# Altium schematic sheet Ledtourch.SchDoc
size A; SheetNumber: 1; SheetTotal: 1
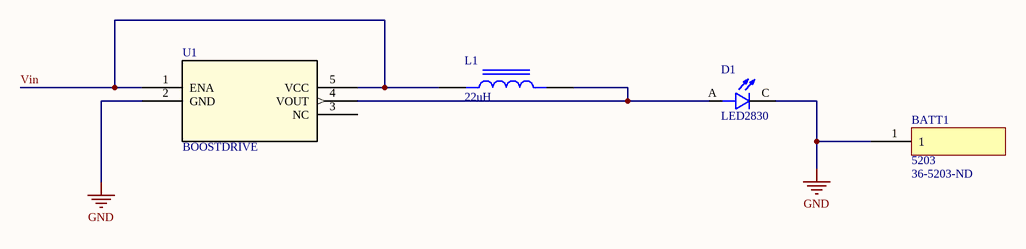
[diagram p0: Ledtourch.SchDoc]

## Parts
BATT1  5203  Supplier Part Number 1: 36-5203-ND  [AAA_BATT_SPRING_SOL]
D1  LED2830  [LED_OF-SMD2835Y]
L1  22uH  [IND_ASPI-0315S-220M-T]
U1  BOOSTDRIVE  [TSOT23-5_ZXLD383_DIO]

## Nets
GND: BATT1.1 D1.C U1.2(GND)
Vin: L1.1 U1.1(ENA) U1.5(VCC)
NetD1_A: D1.A L1.2 U1.4(VOUT)

Not connected (* = marked no-connect by the designer): U1 3(NC)

## Library data of the parts
BATT1 = 5203: 3M Half Facepiece Disposable Respirator Assembly 5203, OrganicVapor/Acid Gas; Manufacturer: Keystone Electronics; Supplier 1: Digikey; Manufacturer Part Number: 5203; RoHS: Yes; Category: Batteries and Accessories; Stock 1: 18441; Pricing 1: 1=0.45, 10=0.372, 25=0.3452, 100=0.3086, 500=0.271, 1000=0.25623, 2500=0.23794, 5000=0.22497 (USD); ComponentLink1URL: https://datasheet.ciiva.com/3/5203-3938.pdf?src-supplier=Digikey; ComponentLink1Description: https://datasheet.ciiva.com/3/5203-3938.pdf?src-supplier=Digikey; ComponentLink2URL: https://datasheet.ciiva.com/11714/0900766b8001d7c7-11714676.pdf?src-supplier=Rs; ComponentLink2Description: https://datasheet.ciiva.com/11714/0900766b8001d7c7-11714676.pdf?src-supplier=Rs; ComponentLink3URL: https://datasheet.ciiva.com/1390/1718267-1390390.pdf?src-supplier=Element14; ComponentLink3Description: https://datasheet.ciiva.com/1390/1718267-1390390.pdf?src-supplier=Element14; ComponentLink4URL: https://datasheet.ciiva.com/16499/m60-2p14-16499587.pdf?src-supplier=Future+Electronics; ComponentLink4Description: https://datasheet.ciiva.com/16499/m60-2p14-16499587.pdf?src-supplier=Future+Electronics
D1 = BXEN-40E-13H-9B-00-0-0: LED Uni-Color White 127lm 4000K Chip LED 2-Pin SMD T/R; Manufacturer: Bridgelux; Test Current: 100mA; Forward Voltage: 9.2V; Color Rendering Index (CRI): 80; Max Current Rating: 120mA; Viewing Angle: 116°; Thermal Resistance of Package: 10°C/W; Supplier 1: Digikey; Manufacturer Part Number: BXEN-40E-13H-9B-00-0-0; RoHS: No; Stock 1: 17000; Pricing 1: 17000=0.03041, 34000=0.02845, 51000=0.02747, 85000=0.02639, 119000=0.02576, 170000=0.02515 (USD); Mount: Surface Mount; Case/Package: 1113; Color: White; Case Code (Imperial): 1113; Correlated Color Temperature (CCT): 4000K; Packaging: Cut Tape; Series: 2835; ComponentLink1URL: http://www.bridgelux.com/sites/default/files/resource_media/DS58_Rev%20B%20Gen2%20SMD%202835%201W%209V%20Data%20sheet.pdf?src-supplier=Digikey; ComponentLink1Description: http://www.bridgelux.com/sites/default/files/resource_media/DS58_Rev%20B%20Gen2%20SMD%202835%201W%209V%20Data%20sheet.pdf?src-supplier=Digikey; Supplier Part Number 1: 976-1620-2-ND
L1 = ASPI-0315S-220M-T: Inductor Power Shielded Wirewound 22uH 20% 100KHz 400mA 430mOhm DCR T/R; Manufacturer: Abracon; Supplier 1: Digikey; Manufacturer Part Number: ASPI-0315S-220M-T; RoHS: Yes; Category: Fixed Inductors; Stock 1: 2923; Pricing 1: 1=0.54, 10=0.446, 100=0.3666, 1000=0.30148 (USD); ComponentLink1URL: https://datasheet.ciiva.com/1080/aspi-s315-4614rd-1080391.pdf?src-supplier=Digikey; ComponentLink1Description: https://datasheet.ciiva.com/1080/aspi-s315-4614rd-1080391.pdf?src-supplier=Digikey; ComponentLink2URL: https://datasheet.ciiva.com/1080/aspi-0315s-1080392.pdf?src-supplier=Digikey; ComponentLink2Description: https://datasheet.ciiva.com/1080/aspi-0315s-1080392.pdf?src-supplier=Digikey; ComponentLink3URL: https://datasheet.ciiva.com/8518/aspi-0315s-8518249.pdf?src-supplier=Avnet; ComponentLink3Description: https://datasheet.ciiva.com/8518/aspi-0315s-8518249.pdf?src-supplier=Avnet; Supplier Part Number 1: 535-ASPI-0315S-220M-TCT-ND
U1 = ZXLD383ET5TA: ZXLD383 Series 50 mA 330 kHz Single or Multi Cell LED Driver Solution TSOT-23-5; Manufacturer: Diodes Zetex; Max Power Dissipation: 450mW; Output Voltage: 20V; Max Supply Voltage: 3.3V; Min Supply Voltage: 900mV; Number of Outputs: 1; Frequency: 330kHz; Max Supply Current: 20mA; Output Current per Channel: 320mA; Topology: Boost; Supplier 1: Digikey; Manufacturer Part Number: ZXLD383ET5TA; RoHS: No; Category: LED Drivers; Stock 1: 45571; Pricing 1: 1=1.66, 10=1.023, 25=0.8572, 100=0.6693, 250=0.577, 500=0.52018, 1000=0.47257 (USD); Mount: Surface Mount; Case/Package: TSOT; Number of Pins: 5; Min Operating Temperature: -20°C; Max Operating Temperature: 85°C; Packaging: Tape and Reel; Package Quantity: 3000; Power Dissipation: 450mW; Series: -; Switching Frequency-Max: 330kHz; Supply Current: 20mA; Length: 2.9mm; Width: 1.6mm; Height: 0.9mm; Radiation Hardening: No; Reach SVHC Compliant: Yes; Lead Free: Lead Free; RoHS Compliant: No; ComponentLink1URL: https://datasheet.ciiva.com/3164/zxld383-3164098.pdf?src-supplier=Avnet; ComponentLink1Description: https://datasheet.ciiva.com/3164/zxld383-3164098.pdf?src-supplier=Avnet; ComponentLink2URL: https://datasheet.ciiva.com/3164/zxld383-3164098.pdf?src-supplier=Mouser; ComponentLink2Description: https://datasheet.ciiva.com/3164/zxld383-3164098.pdf?src-supplier=Mouser; ComponentLink3URL: https://datasheet.ciiva.com/15135/getdatasheetpartid-662810-15135755.pdf?src-supplier=Verical; ComponentLink3Description: https://datasheet.ciiva.com/15135/getdatasheetpartid-662810-15135755.pdf?src-supplier=Verical; ComponentLink4URL: https://datasheet.ciiva.com/1944/zxld383-1944733.pdf?src-supplier=Digikey; ComponentLink4Description: https://datasheet.ciiva.com/1944/zxld383-1944733.pdf?src-supplier=Digikey; ComponentLink5URL: https://datasheet.ciiva.com/1944/zxld383-1944734.pdf?src-supplier=Digikey; ComponentLink5Description: https://datasheet.ciiva.com/1944/zxld383-1944734.pdf?src-supplier=Digikey; ComponentLink6URL: https://datasheet.ciiva.com/1944/zxld383-1944735.pdf?src-supplier=Digikey; ComponentLink6Description: https://datasheet.ciiva.com/1944/zxld383-1944735.pdf?src-supplier=Digikey; ComponentLink7URL: https://datasheet.ciiva.com/16508/zxld383-16508469.pdf?src-supplier=Future+Electronics; ComponentLink7Description: https://datasheet.ciiva.com/16508/zxld383-16508469.pdf?src-supplier=Future+Electronics; Supplier Part Number 1: ZXLD383ET5CT-ND